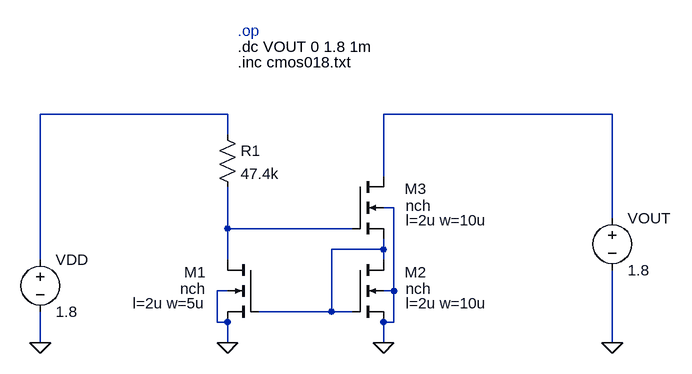
[diagram p0: schematic 1_WPZ.asc]
1_WPZ.asc, the LTspice schematic file:
Version 4
SHEET 1 1180 952
WIRE 176 480 -112 480
WIRE 768 480 416 480
WIRE 176 512 176 480
WIRE 416 576 416 480
WIRE 432 624 416 624
WIRE 768 640 768 480
WIRE 176 656 176 592
WIRE 368 656 176 656
WIRE 416 688 416 672
WIRE 416 688 336 688
WIRE -112 704 -112 480
WIRE 176 704 176 656
WIRE 416 704 416 688
WIRE 176 752 160 752
WIRE 432 752 432 624
WIRE 432 752 416 752
WIRE 336 784 336 688
WIRE 336 784 224 784
WIRE 368 784 336 784
WIRE 160 800 160 752
WIRE 176 800 160 800
WIRE 432 800 432 752
WIRE 432 800 416 800
WIRE -112 832 -112 784
WIRE 176 832 176 800
WIRE 416 832 416 800
WIRE 768 832 768 720
FLAG 416 832 0
FLAG -112 832 0
FLAG 176 832 0
FLAG 768 832 0
DATAFLAG 512 560 "Is(M3)"
DATAFLAG 64 560 "I(R1)"
SYMBOL voltage -112 688 R0
SYMATTR InstName VDD
SYMATTR Value 1.8
SYMBOL nmos4 224 704 M0
WINDOW 123 82 67 Left 2
WINDOW 0 81 19 Left 2
WINDOW 3 82 45 Left 2
SYMATTR Value2 l=2u w=5u
SYMATTR InstName M1
SYMATTR Value nch
SYMBOL nmos4 368 704 R0
WINDOW 123 82 67 Left 2
WINDOW 0 81 19 Left 2
WINDOW 3 82 45 Left 2
SYMATTR Value2 l=2u w=10u
SYMATTR InstName M2
SYMATTR Value nch
SYMBOL nmos4 368 576 R0
WINDOW 123 82 67 Left 2
WINDOW 0 81 19 Left 2
WINDOW 3 82 45 Left 2
SYMATTR Value2 l=2u w=10u
SYMATTR InstName M3
SYMATTR Value nch
SYMBOL voltage 768 624 R0
WINDOW 123 0 0 Left 0
WINDOW 39 0 0 Left 0
SYMATTR InstName VOUT
SYMATTR Value 1.8
SYMBOL res 160 496 R0
SYMATTR InstName R1
SYMATTR Value 47.4k
TEXT 192 400 Left 2 !.inc cmos018.txt
TEXT 192 376 Left 2 !.dc VOUT 0 1.8 1m
TEXT 192 352 Left 2 ;.op

The netlist it stands for:
* 1_WPZ.asc
VDD N001 0 1.8
M1 N003 N004 0 0 nch l=2u w=5u
M2 N004 N004 0 0 nch l=2u w=10u
M3 N002 N003 N004 0 nch l=2u w=10u
VOUT N002 0 1.8
R1 N001 N003 47.4k
.model NMOS NMOS
.model PMOS PMOS
.lib standard.mos
.inc cmos018.txt
.dc VOUT 0 1.8 1m
* .op
.backanno
.end